# EAGLE design M20050-1 GPS Breakout Board (EAGLE 9.5.0)
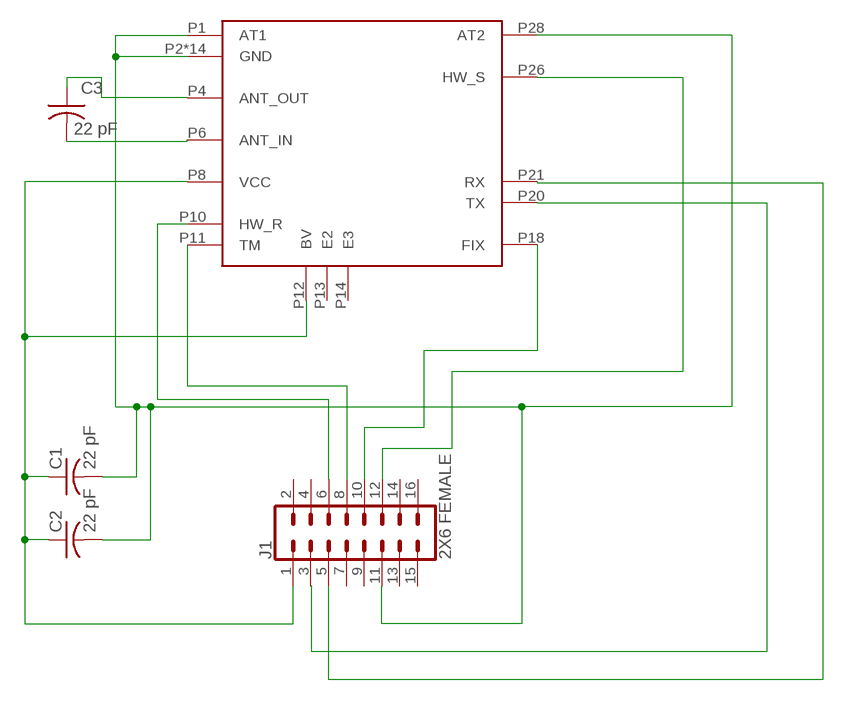
[diagram p0: schematic, sheet 1]

## Parts
A1  GPS_M20050-1  [M20050-1_GPS]
C1  22 pF  C-ALL_PACKAGESC1206  [C1206]
C2  22 pF  C-ALL_PACKAGESC1206  [C1206]
C3  22 pF  C-ALL_PACKAGESC1206  [C1206]
J1  2X6 FEMALE  SENSOR_BREAKOUTPTH_FEMALE  [2X7]

## Nets
GND: A1.P1(AT1) A1.P2(GND) A1.P3(GND) A1.P5(GND) A1.P7(GND) A1.P9(GND) A1.P15(GND) A1.P16(GND) A1.P17(GND) A1.P19(GND) A1.P22(GND) A1.P23(GND) A1.P24(GND) A1.P25(GND) A1.P27(GND) A1.P28(AT2) C1.2 C2.2 J1.11
N$1: A1.P8(VCC) A1.P12(BV) C1.1 C2.1 J1.1
N$2: A1.P20(TX) J1.3
N$4: A1.P21(RX) J1.5
N$5: A1.P4(ANT_OUT) C3.1
N$6: A1.P6(ANT_IN) C3.2
N$7: A1.P26(HW_S) J1.12
N$8: A1.P18(FIX) J1.10
N$9: A1.P11(TM) J1.8
N$10: A1.P10(HW_R) J1.6
Unconnected: A1.P13(E2) A1.P14(E3) J1.2 J1.4 J1.7 J1.9 J1.13 J1.14 J1.15 J1.16

## Library data of the parts
A1 = RTR:GPS_M20050-1
C1-C3 = RTR:C-ALL_PACKAGES: CAPACITOR, American symbol
J1 = RTR:SENSOR_BREAKOUT: .1 inch-spaced 12P sensor breakout Used as a generalized connector for attaching new sensors; PROD_ID: CONN-12423

## Board
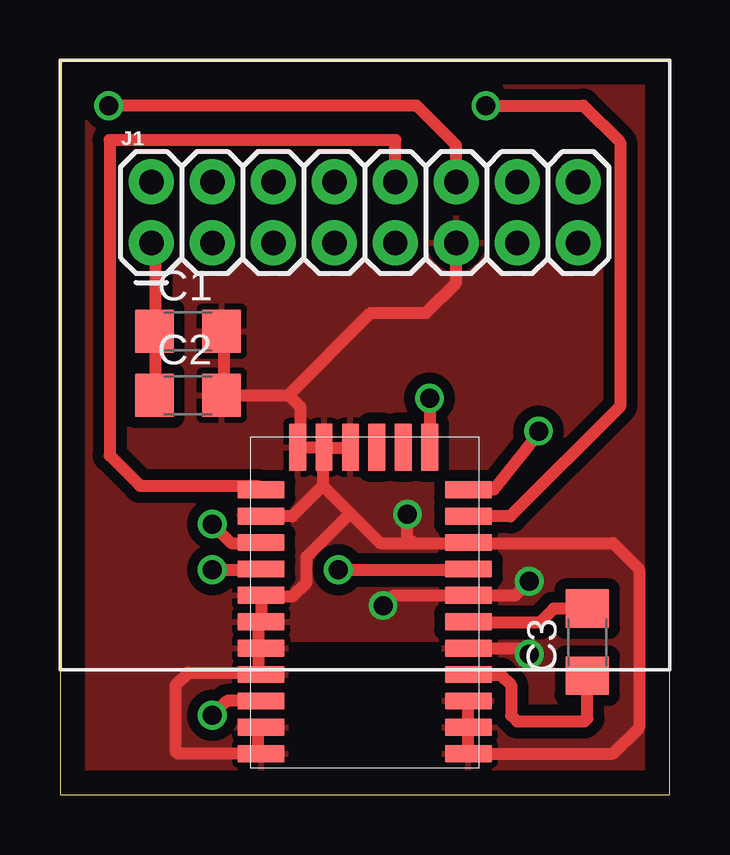
[diagram p1: board, top side]
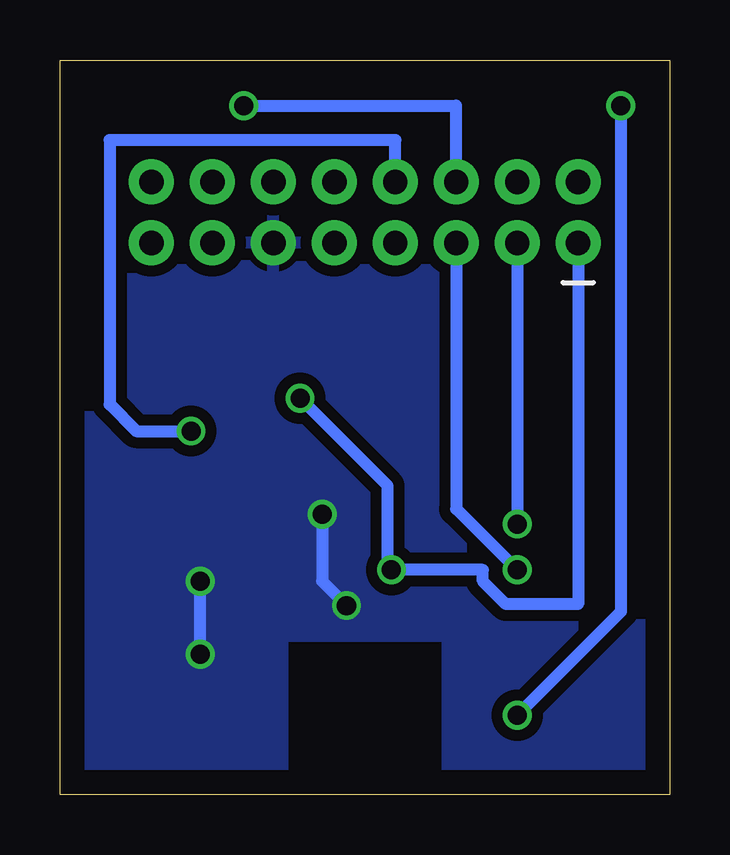
[diagram p2: board, bottom side, seen from below]

Size 25.4 x 30.61 mm. Coordinates in mm from the lower left corner, seen from the top.
Outline: 0,0 25.4,0 25.4,30.61 0,30.61 0,0
Copper layers (1*16): Top 0.035mm / dielectric 1.5mm / Bottom 0.035mm
Design rules "default *": minimum track width 20mil, minimum drill 31.25mil, track to track 18mil, track to pad 18mil, pad to pad 6mil, via to via 18mil, smd to smd 6mil, copper to edge 40mil, drill to drill 6mil, minimum pad ring 10mil, minimum via ring 8mil, stop-mask expansion 4mil, vias tented up to drill 0mil, thermal gap 10mil
tKeepout: area 9.5,0 to 15.9,6.3
tRestrict: area 9.5,0 to 15.9,6.3
bRestrict: area 9.5,0 to 15.9,6.3

### Footprints (pad centres in the part's own frame; a part is rotated, then mirrored left to right if it is on the bottom)
M20050-1_GPS = smd 1.94 x 0.7: P1 -4.32,6.3; P2 -4.32,5.2; P3 -4.32,4.1; P4 -4.32,3; P5 -4.32,1.9; P6 -4.32,0.8; P7 -4.32,-0.3; P8 -4.32,-1.4; P9 -4.32,-2.5; P10 -4.32,-3.6; P11 -4.32,-4.7; P18 4.32,-4.7; P19 4.32,-3.6; P20 4.32,-2.5; P21 4.32,-1.4; P22 4.32,-0.3; P23 4.32,0.8; P24 4.32,1.9; P25 4.32,3; P26 4.32,4.1; P27 4.32,5.2; P28 4.32,6.3 | smd 0.7 x 1.94: P12 -2.7,-6.47; P13 -1.6,-6.47; P14 -0.5,-6.47; P15 0.6,-6.47; P16 1.7,-6.47; P17 2.8,-6.47
C1206 = smd 1.6 x 1.8: 1 -1.4,0; 2 1.4,0
2X7 = drill 1.016 pad 1.88: 1 -8.89,5.08; 2 -8.89,7.62; 3 -6.35,5.08; 4 -6.35,7.62; 5 -3.81,5.08; 6 -3.81,7.62; 7 -1.27,5.08; 8 -1.27,7.62; 9 1.27,5.08; 10 1.27,7.62; 11 3.81,5.08; 12 3.81,7.62; 13 6.35,5.08; 14 6.35,7.62; 15 8.89,5.08; 16 8.89,7.62

### Placement (x,y rotation side)
A1  12.7,8 180 top
C1  5.33,19.3 0 top
C2  5.33,16.64 0 top
C3  21.97,6.35 90 top
J1  12.7,17.91 0 top

### Tracks (layer width: path | path; a pad name or v marks a point on that pad's centre or on a via)
GND  (via drill 0.79)
  Top 0.508: C1.2 6.83,19.24 6.83,16.76 C2.2 9.53,16.64 | 10.95,12.86 9.68,11.59 8.41,11.59 A1.P19 | 10.95,12.86 10.95,14.45 A1.P16 | 10,14.45 10.79,14.45 A1.P16 | 10,14.45 A1.P17 | A1.P15 12.06,14.45 11.11,14.45 A1.P16 | 14.73,10.48 13.34,10.48 12.03,11.78 | 14.73,10.48 16.99,10.48 A1.P9 17.14,10.48 23.05,10.48 24.13,9.4 24.13,2.79 23.04,1.7 A1.P1 17.02,2.57 17.14,2.7 A1.P2 A1.P3 | 10.95,12.86 12.03,11.78 | 14.73,10.48 14.48,10.73 v14.48,11.68 | v13.46,7.87 13.89,8.3 A1.P7 18.97,8.3 v19.56,8.89 | A1.P5 19.3,6.1 v19.56,5.84 | 8.26,5.08 5.33,5.08 4.83,4.57 4.83,1.78 4.9,1.7 A1.P28 8.26,1.91 8.26,2.54 A1.P27 | 8.26,5.08 8.41,5.08 A1.P25 8.26,5.08 | 8.26,6.35 8.26,5.08 | 8.26,6.35 8.26,6.99 A1.P23 8.41,7.3 8.41,8.26 A1.P22 8.57,8.26 9.68,8.26 10.28,8.85 10.28,9.91 12.03,11.66 12.03,11.78 | 8.26,6.35 A1.P24 | 10,14.45 10,16.16 9.53,16.64 | J1.11 16.51,21.34 15.24,20.07 12.95,20.07 9.53,16.64
  Bottom 0.508: v14.48,11.68 14.48,8.89 v13.46,7.87 | v19.56,5.84 v19.56,8.89
  pour Bottom: -4.57,33.27 -4.57,-3.56 30.48,-3.56 30.48,33.27
  pour Top: -1.02,31.5 -1.02,-1.27 27.43,-1.27 27.43,31.5
N$1  (via drill 0.79)
  Top 0.508: C2.1 3.97,16.76 3.97,19.24 C1.1 3.97,19.56 3.97,22.83 J1.1 | v11.59,9.37 16.99,9.37 A1.P8 | v15.4,16.51 15.4,14.61 A1.P12
  Bottom 0.508: J1.1 3.81,7.94 6.83,7.94 7.78,8.89 7.78,9.37 v11.59,9.37 11.75,9.53 11.75,12.86 v15.4,16.51
N$2  (via drill 0.79)
  Top 0.508: v6.35,11.27 7.14,10.48 8.26,10.48 A1.P20
  Bottom 0.508: J1.3 v6.35,11.27
N$4  (via drill 0.79)
  Top 0.508: v6.35,9.37 8.26,9.37 A1.P21
  Bottom 0.508: v6.35,9.37 8.89,11.91 J1.5
N$5
  Top 0.508: A1.P4 18.37,5 18.8,4.57 18.8,3.3 19.05,3.05 21.84,3.05 21.97,3.17 C3.1
N$6
  Top 0.508: C3.2 20.57,7.75 19.98,7.16 17.06,7.16 A1.P6
N$7  (via drill 0.79)
  Top 0.508: J1.12 16.51,27.05 14.86,28.7 v2.03,28.7 | A1.P26 6.95,3.9 v6.35,3.3
  Bottom 0.508: v6.35,3.3 2.03,7.62 v2.03,28.7
N$8
  Top 0.508: J1.10 13.97,27.27 2.06,27.27 2.06,14.13 3.33,12.86 8.26,12.86 A1.P18
N$9  (via drill 0.79)
  Top 0.508: v19.94,15.14 19.94,15.05 18.08,12.7 A1.P11
  Bottom 0.508: v19.94,15.14 22.23,15.14 23.34,16.26 23.34,27.27 11.43,27.27 J1.8
N$10  (via drill 0.79)
  Top 0.508: v17.75,28.7 21.81,28.7 23.34,27.18 23.34,16.16 18.76,11.59 17.14,11.59 A1.P10
  Bottom 0.508: v17.75,28.7 8.89,28.7 J1.6